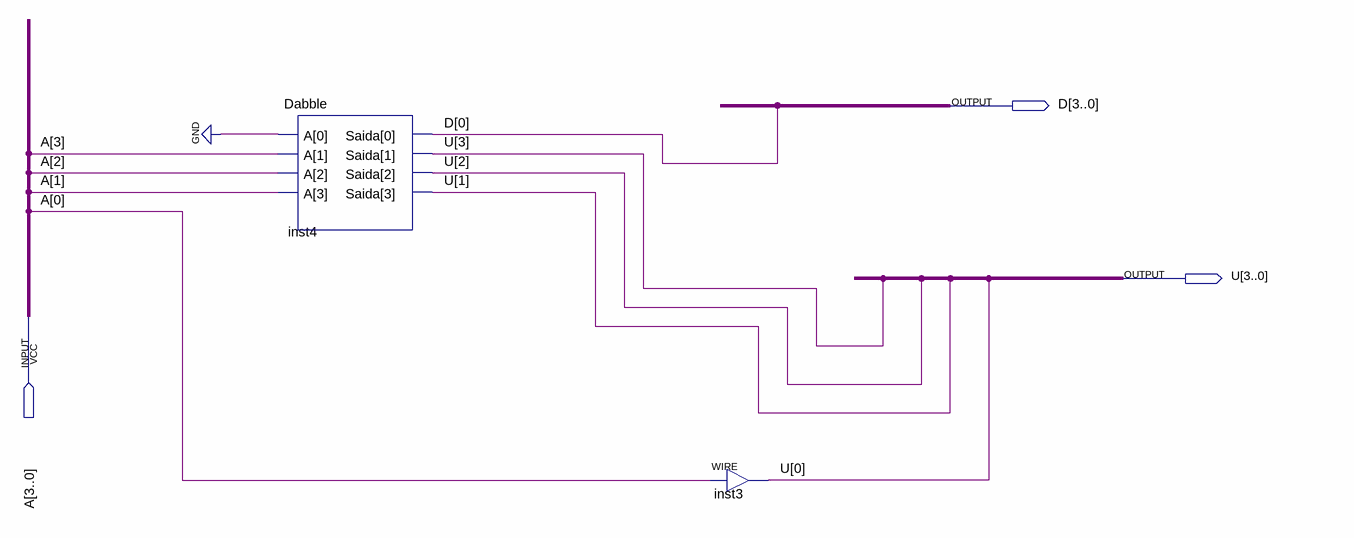
[diagram p0: schematic sheet]
// Quartus schematic DecoderQuatro.bdf as structural Verilog: 2 symbols, 3 pins
module DecoderQuatro (
  input  [3:0] A,
  output [3:0] D,
  output [3:0] U
);

  Dabble inst4 (.A({A[1], A[2], A[3], 1'b0}), .Saida({U[1], U[2], U[3], D[0]}));
  assign U[0] = A[0];  // WIRE inst3
endmodule
